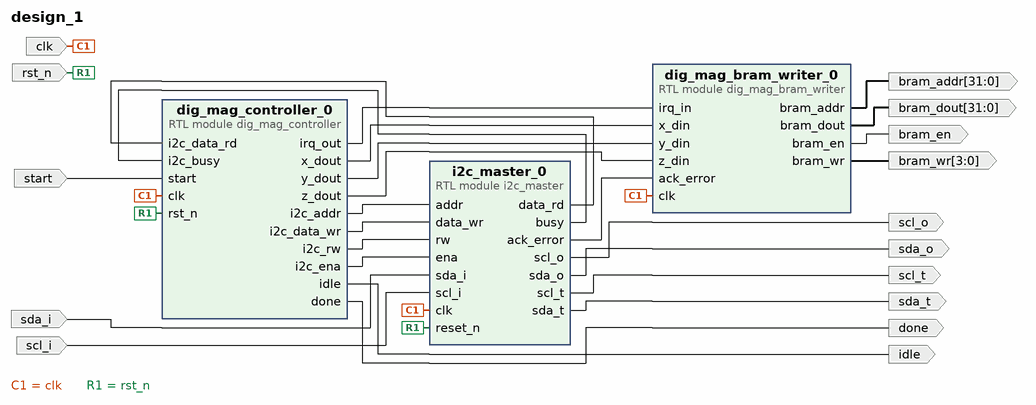
[diagram p0: block diagram of the top level]
# Vivado block design design_1, xczu3eg-sbva484-1-i, Vivado 2020.2
create_bd_design design_1

create_bd_port -dir O -from 31 -to 0 bram_addr
create_bd_port -dir O -from 31 -to 0 bram_dout
create_bd_port -dir O bram_en
create_bd_port -dir O -from 3 -to 0 bram_wr
create_bd_port -dir I -type clk clk
create_bd_port -dir I -type rst rst_n
create_bd_port -dir O idle
create_bd_port -dir I start
create_bd_port -dir O done
create_bd_port -dir I sda_i
create_bd_port -dir O sda_o
create_bd_port -dir O scl_o
create_bd_port -dir O scl_t
create_bd_port -dir I scl_i
create_bd_port -dir O sda_t

create_bd_cell -type module -reference dig_mag_bram_writer dig_mag_bram_writer_0
create_bd_cell -type module -reference i2c_master i2c_master_0
create_bd_cell -type module -reference dig_mag_controller dig_mag_controller_0

# ---- connections ----

connect_bd_net -net clk_0_1 [get_bd_ports clk] \
  [get_bd_pins dig_mag_bram_writer_0/clk] [get_bd_pins i2c_master_0/clk] [get_bd_pins dig_mag_controller_0/clk]
connect_bd_net [get_bd_pins dig_mag_bram_writer_0/bram_addr] [get_bd_ports bram_addr]
connect_bd_net [get_bd_pins dig_mag_bram_writer_0/bram_dout] [get_bd_ports bram_dout]
connect_bd_net [get_bd_pins dig_mag_bram_writer_0/bram_en] [get_bd_ports bram_en]
connect_bd_net [get_bd_pins dig_mag_bram_writer_0/bram_wr] [get_bd_ports bram_wr]
connect_bd_net [get_bd_pins dig_mag_controller_0/i2c_addr] [get_bd_pins i2c_master_0/addr]
connect_bd_net [get_bd_pins dig_mag_controller_0/i2c_data_wr] [get_bd_pins i2c_master_0/data_wr]
connect_bd_net [get_bd_pins dig_mag_controller_0/i2c_rw] [get_bd_pins i2c_master_0/rw]
connect_bd_net [get_bd_pins dig_mag_controller_0/irq_out] [get_bd_pins dig_mag_bram_writer_0/irq_in]
connect_bd_net [get_bd_pins dig_mag_controller_0/x_dout] [get_bd_pins dig_mag_bram_writer_0/x_din]
connect_bd_net [get_bd_pins dig_mag_controller_0/y_dout] [get_bd_pins dig_mag_bram_writer_0/y_din]
connect_bd_net [get_bd_pins dig_mag_controller_0/z_dout] [get_bd_pins dig_mag_bram_writer_0/z_din]
connect_bd_net [get_bd_pins i2c_master_0/ack_error] [get_bd_pins dig_mag_bram_writer_0/ack_error]
connect_bd_net [get_bd_pins i2c_master_0/data_rd] [get_bd_pins dig_mag_controller_0/i2c_data_rd]
connect_bd_net -net rst_n_0_1 [get_bd_ports rst_n] [get_bd_pins i2c_master_0/reset_n] [get_bd_pins dig_mag_controller_0/rst_n]
connect_bd_net [get_bd_pins dig_mag_controller_0/i2c_ena] [get_bd_pins i2c_master_0/ena]
connect_bd_net [get_bd_pins i2c_master_0/busy] [get_bd_pins dig_mag_controller_0/i2c_busy]
connect_bd_net [get_bd_pins dig_mag_controller_0/idle] [get_bd_ports idle]
connect_bd_net -net start_0_1 [get_bd_ports start] [get_bd_pins dig_mag_controller_0/start]
connect_bd_net [get_bd_pins dig_mag_controller_0/done] [get_bd_ports done]
connect_bd_net -net sda_i_0_1 [get_bd_ports sda_i] [get_bd_pins i2c_master_0/sda_i]
connect_bd_net [get_bd_pins i2c_master_0/sda_o] [get_bd_ports sda_o]
connect_bd_net [get_bd_pins i2c_master_0/scl_o] [get_bd_ports scl_o]
connect_bd_net [get_bd_pins i2c_master_0/scl_t] [get_bd_ports scl_t]
connect_bd_net -net scl_i_0_1 [get_bd_ports scl_i] [get_bd_pins i2c_master_0/scl_i]
connect_bd_net [get_bd_pins i2c_master_0/sda_t] [get_bd_ports sda_t]

validate_bd_design
save_bd_design
